# EasyEDA Pro project the ties .epro, schematic Schematic1

## Sheets
1 P1: Board Name: Board1; Create Date: 2026-04-29; Page Name: P1; Project Name: the ties 1; Schematic Name: Schematic1; Update Date: 2026-05-16; Company: EasyEDA.com; Page Size: A4; Version: V1.0
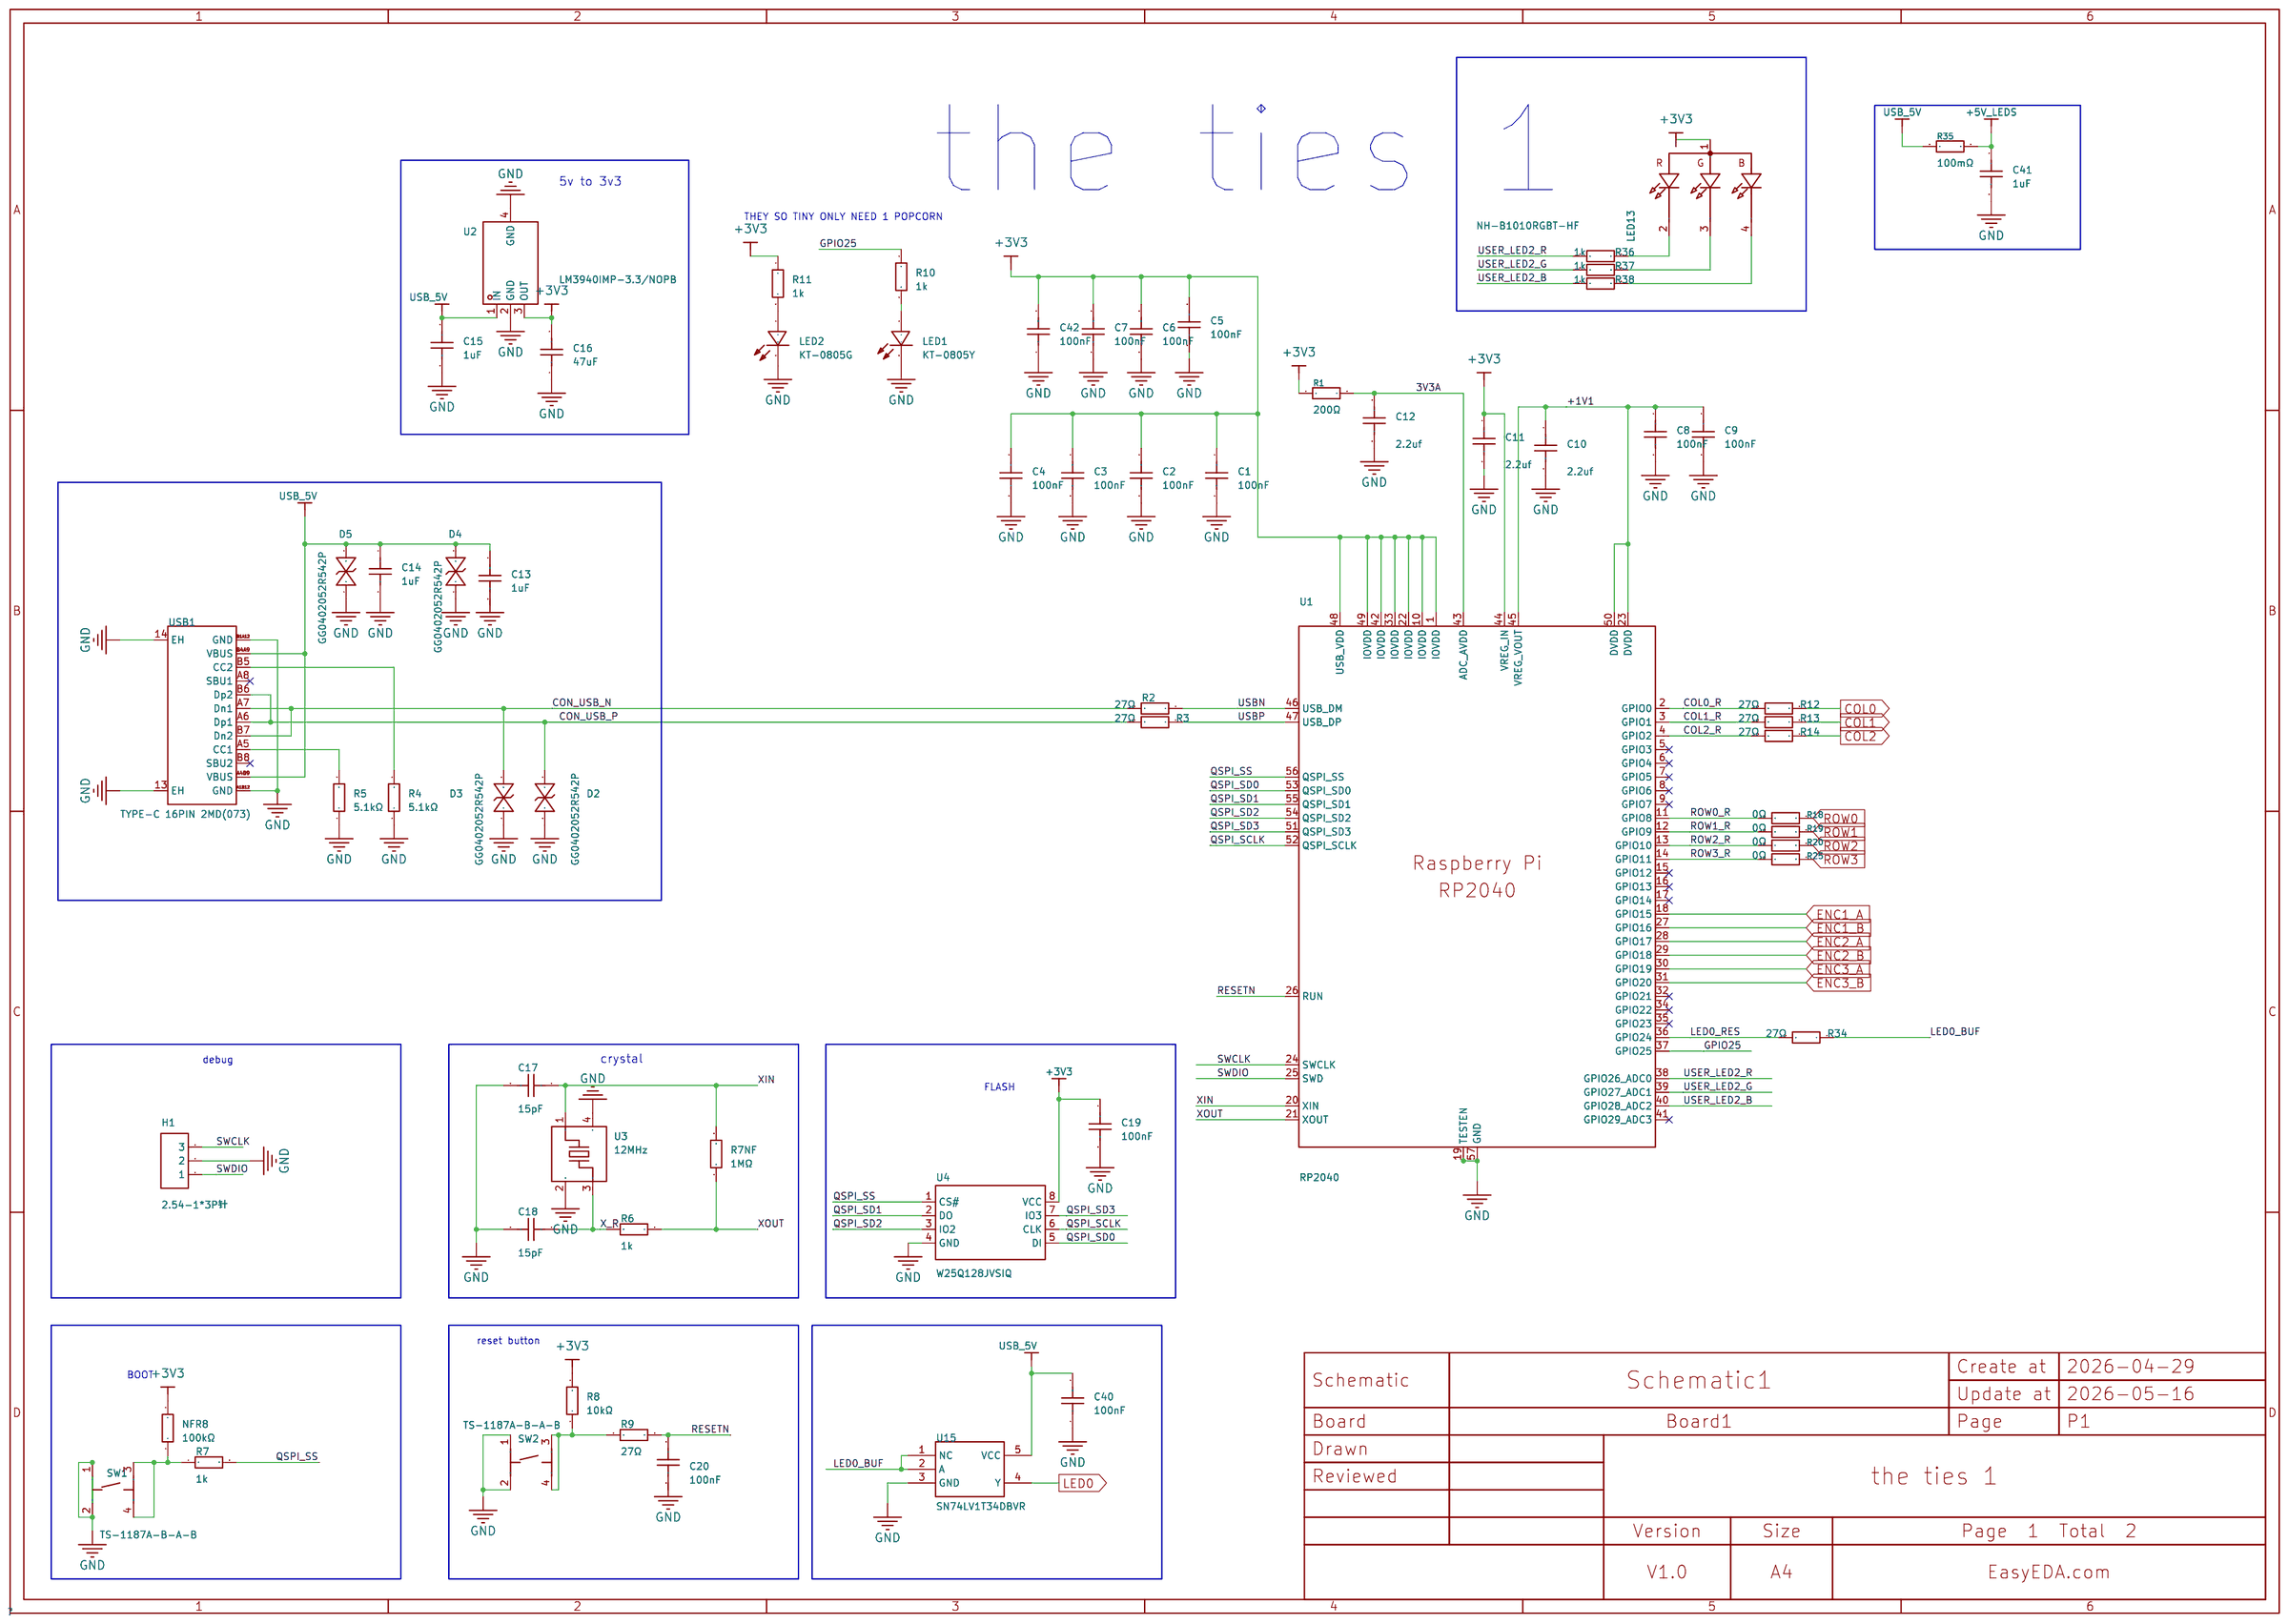
[diagram p0: P1]
2 P2: Page Name: P2
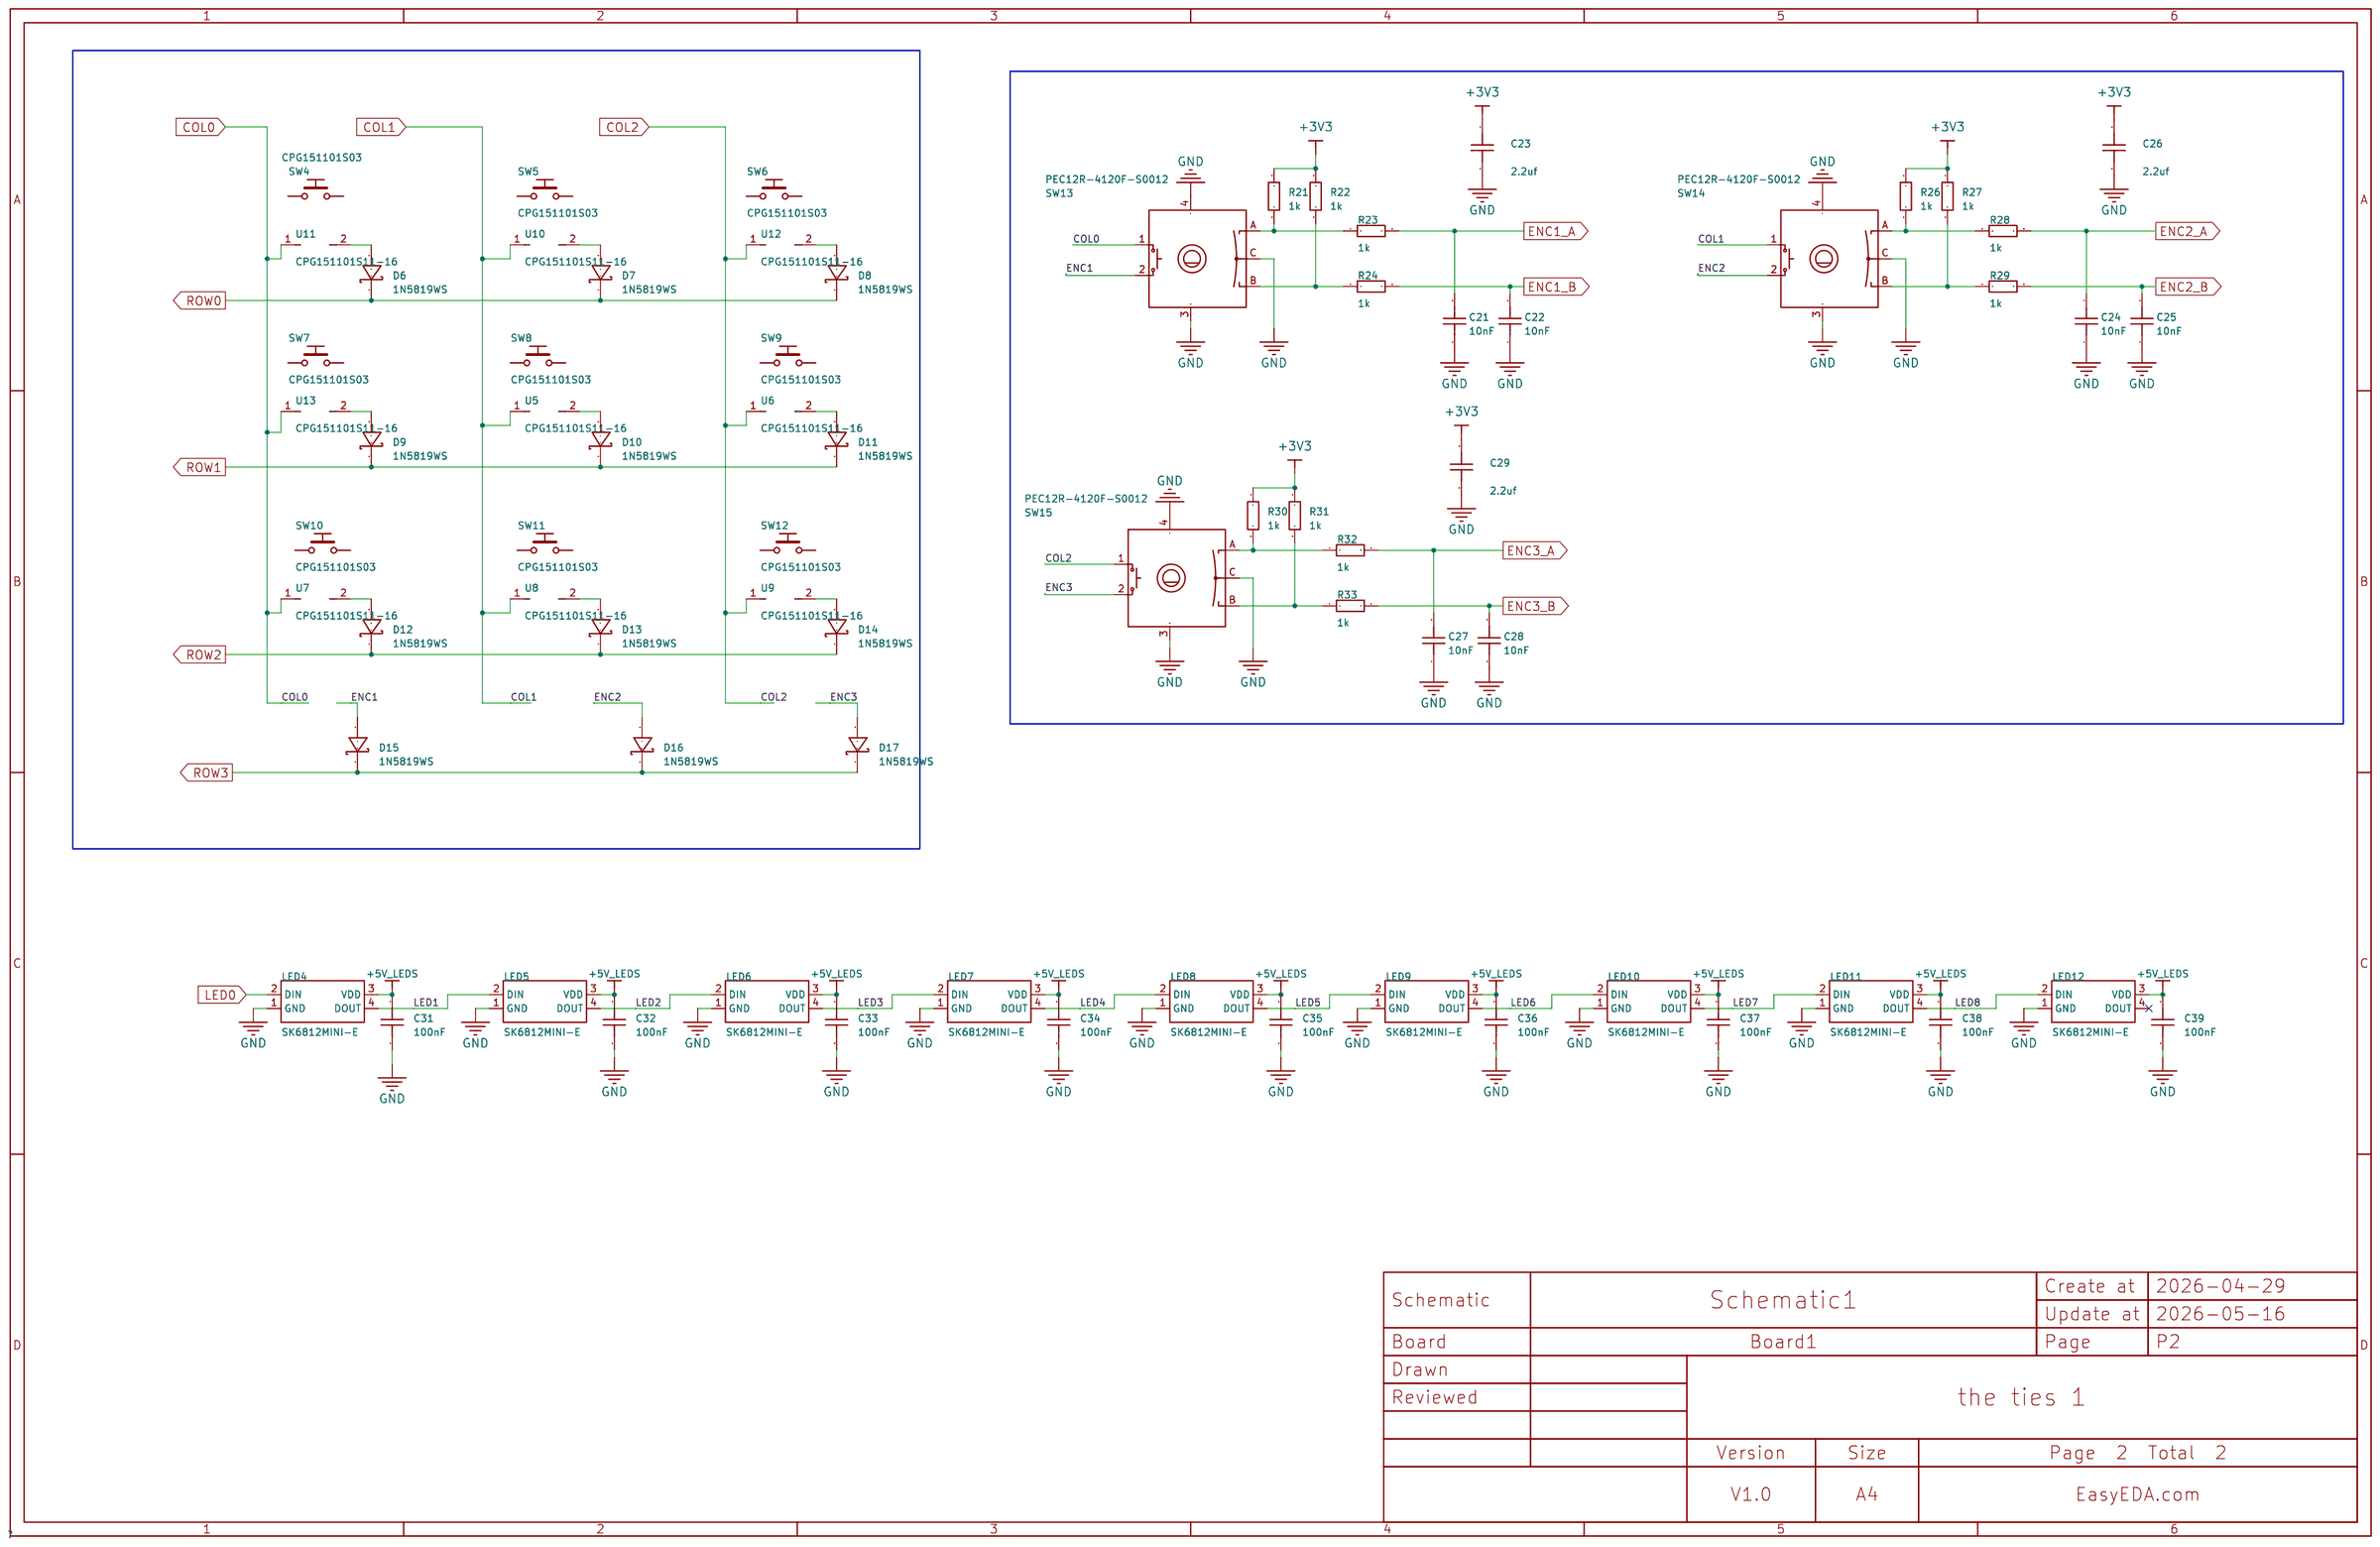
[diagram p1: P2]

## Parts
sheet P1
C1  100nF  [C0603]
C2  100nF  [C0603]
C3  100nF  [C0603]
C4  100nF  [C0603]
C5  100nF  [C0603]
C6  100nF  [C0603]
C7  100nF  [C0603]
C8  100nF  [C0603]
C9  100nF  [C0603]
C10  2.2uf  [C0603]
C11  2.2uf  [C0603]
C12  2.2uf  [C0603]
C13  1uF  [C0603]
C14  1uF  [C0603]
C15  1uF  [C0603]
C16  47uF  [C1206]
C17  15pF  [C0402]
C18  15pF  [C0402]
C19  100nF  [C0603]
C20  100nF  [C0603]
C40  100nF  [C0603]
C41  1uF  [C0603]
C42  100nF  [C0603]
D2  GG0402052R542P  [D0402-BI]
D3  GG0402052R542P  [D0402-BI]
D4  GG0402052R542P  [D0402-BI]
D5  GG0402052R542P  [D0402-BI]
H1  2.54-1*3P针  [HDR-TH_3P-P2.54-V-M-1]
LED1  KT-0805Y  [LED0805-R-RD]
LED2  KT-0805G  [LED0805-R-RD]
LED13  NH-B1010RGBT-HF  [LED-ARRAY-SMD_4P-L1.0-W1.0-TR_NH-B1010RGBT]
NFR8  100kΩ  [R0603]  (no BOM)
R1  200Ω  [R0402]
R2  27Ω  [R0402]
R3  27Ω  [R0402]
R4  5.1kΩ  [R0603]
R5  5.1kΩ  [R0603]
R6  1k  [R0603]
R7  1k  [R0603]
R7NF  1MΩ  [R0603]  (no BOM)
R8  10kΩ  [R0603]
R9  27Ω  [R0402]
R10  1k  [R0603]
R11  1k  [R0603]
R12  27Ω  [R0402]
R13  27Ω  [R0402]
R14  27Ω  [R0402]
R18  0Ω  [R0402]
R19  0Ω  [R0402]
R20  0Ω  [R0402]
R25  0Ω  [R0402]
R34  27Ω  [R0402]
R35  100mΩ  [R1206]
R36  1k  [R0603]
R37  1k  [R0603]
R38  1k  [R0603]
SW1  TS-1187A-B-A-B  [SW-SMD_4P-L5.1-W5.1-P3.70-LS6.5-TL_H1.5]
SW2  TS-1187A-B-A-B  [SW-SMD_4P-L5.1-W5.1-P3.70-LS6.5-TL_H1.5]
U1  RP2040  [LQFN-56_L7.0-W7.0-P0.4-EP]
U2  LM3940IMP-3.3/NOPB  [SOT-223_L6.5-W3.5-P2.30-LS7.0-BR]
U3  12MHz  [CRYSTAL-SMD_4P-L3.2-W2.5-BL]
U4  W25Q128JVSIQ  [SOIC-8_L5.3-W5.3-P1.27-LS8.0-BL]
U15  SN74LV1T34DBVR  [SOT-23-5_L2.9-W1.6-P0.95-LS2.8-BR]
USB1  TYPE-C 16PIN 2MD(073)  [USB-C-SMD_TYPE-C-16PIN-2MD-073]
sheet P2
C21  10nF  [C0603]
C22  10nF  [C0603]
C23  2.2uf  [C0603]
C24  10nF  [C0603]
C25  10nF  [C0603]
C26  2.2uf  [C0603]
C27  10nF  [C0603]
C28  10nF  [C0603]
C29  2.2uf  [C0603]
C31  100nF  [C0603]
C32  100nF  [C0603]
C33  100nF  [C0603]
C34  100nF  [C0603]
C35  100nF  [C0603]
C36  100nF  [C0603]
C37  100nF  [C0603]
C38  100nF  [C0603]
C39  100nF  [C0603]
D6  1N5819WS  [SOD-323_L1.8-W1.3-LS2.5-RD]
D7  1N5819WS  [SOD-323_L1.8-W1.3-LS2.5-RD]
D8  1N5819WS  [SOD-323_L1.8-W1.3-LS2.5-RD]
D9  1N5819WS  [SOD-323_L1.8-W1.3-LS2.5-RD]
D10  1N5819WS  [SOD-323_L1.8-W1.3-LS2.5-RD]
D11  1N5819WS  [SOD-323_L1.8-W1.3-LS2.5-RD]
D12  1N5819WS  [SOD-323_L1.8-W1.3-LS2.5-RD]
D13  1N5819WS  [SOD-323_L1.8-W1.3-LS2.5-RD]
D14  1N5819WS  [SOD-323_L1.8-W1.3-LS2.5-RD]
D15  1N5819WS  [SOD-323_L1.8-W1.3-LS2.5-RD]
D16  1N5819WS  [SOD-323_L1.8-W1.3-LS2.5-RD]
D17  1N5819WS  [SOD-323_L1.8-W1.3-LS2.5-RD]
LED4  SK6812MINI-E  [LED-SMD_4P-L3.2-W2.8-LS5.9_SK6812MINI-E]
LED5  SK6812MINI-E  [LED-SMD_4P-L3.2-W2.8-LS5.9_SK6812MINI-E]
LED6  SK6812MINI-E  [LED-SMD_4P-L3.2-W2.8-LS5.9_SK6812MINI-E]
LED7  SK6812MINI-E  [LED-SMD_4P-L3.2-W2.8-LS5.9_SK6812MINI-E]
LED8  SK6812MINI-E  [LED-SMD_4P-L3.2-W2.8-LS5.9_SK6812MINI-E]
LED9  SK6812MINI-E  [LED-SMD_4P-L3.2-W2.8-LS5.9_SK6812MINI-E]
LED10  SK6812MINI-E  [LED-SMD_4P-L3.2-W2.8-LS5.9_SK6812MINI-E]
LED11  SK6812MINI-E  [LED-SMD_4P-L3.2-W2.8-LS5.9_SK6812MINI-E]
LED12  SK6812MINI-E  [LED-SMD_4P-L3.2-W2.8-LS5.9_SK6812MINI-E]
R21  1k  [R0603]
R22  1k  [R0603]
R23  1k  [R0603]
R24  1k  [R0603]
R26  1k  [R0603]
R27  1k  [R0603]
R28  1k  [R0603]
R29  1k  [R0603]
R30  1k  [R0603]
R31  1k  [R0603]
R32  1k  [R0603]
R33  1k  [R0603]
SW4  CPG151101S03  [KEY-TH_CPG1511F01S0X]
SW5  CPG151101S03  [KEY-TH_CPG1511F01S0X]
SW6  CPG151101S03  [KEY-TH_CPG1511F01S0X]
SW7  CPG151101S03  [KEY-TH_CPG1511F01S0X]
SW8  CPG151101S03  [KEY-TH_CPG1511F01S0X]
SW9  CPG151101S03  [KEY-TH_CPG1511F01S0X]
SW10  CPG151101S03  [KEY-TH_CPG1511F01S0X]
SW11  CPG151101S03  [KEY-TH_CPG1511F01S0X]
SW12  CPG151101S03  [KEY-TH_CPG1511F01S0X]
SW13  PEC12R-4120F-S0012  [SW-TH_PEC12R-4120F-S0012]
SW14  PEC12R-4120F-S0012  [SW-TH_PEC12R-4120F-S0012]
SW15  PEC12R-4120F-S0012  [SW-TH_PEC12R-4120F-S0012]
U5  CPG151101S11-16  [SMD_KEYBOARD-SW]
U6  CPG151101S11-16  [SMD_KEYBOARD-SW]
U7  CPG151101S11-16  [SMD_KEYBOARD-SW]
U8  CPG151101S11-16  [SMD_KEYBOARD-SW]
U9  CPG151101S11-16  [SMD_KEYBOARD-SW]
U10  CPG151101S11-16  [SMD_KEYBOARD-SW]
U11  CPG151101S11-16  [SMD_KEYBOARD-SW]
U12  CPG151101S11-16  [SMD_KEYBOARD-SW]
U13  CPG151101S11-16  [SMD_KEYBOARD-SW]

## Library data of the parts
C1-C15 C19-C29 C31-C42 = CAP_0603: Supplier Footprint: 0603
C16 = CL31A476MPHNNNE: Capacitance:47uF Tolerance:±20% Tolerance:±20% Voltage Rating:10V Temperature Coefficient:X5R; LCSC Part Name: 47uF ±20% 10V; Supplier Part: C96123; Manufacturer: SAMSUNG(三星); Supplier Footprint: 1206; JLCPCB Part Class: Basic Part; Datasheet: https://item.szlcsc.com/datasheet/CL31A476MPHNNNE/97327.html; Supplier: LCSC; Tolerance: ±20%; Voltage Rating: 10V; Temperature Coefficient: X5R
C17 C18 = CL05C150JB5NNNC: Capacitance:15pF Tolerance:±5% Tolerance:±5% Voltage Rating:50V Temperature Coefficient:C0G; LCSC Part Name: 15pF ±5% 50V; Supplier Part: C86285; Manufacturer: SAMSUNG(三星); Supplier Footprint: 0402; JLCPCB Part Class: Extended Part; Datasheet: https://item.szlcsc.com/datasheet/CL05C150JB5NNNC/87461.html; Supplier: LCSC; Tolerance: ±5%; Voltage Rating: 50V; Temperature Coefficient: C0G
D2-D5 = GG0402052R542P: Reverse Stand-Off Voltage (Vrwm):5V Clamping Voltage:15.5V Peak Pulse Current (Ipp):3A@8/20us Peak Pulse Power Dissipation (Ppp):46W@8/20us Voltage - Breakdown:5.5V Reverse Leakage Current (Ir):100nA Operating Temperature:-55℃~+125℃ Operating Temperature:; LCSC Part Name: ESD 5V截止 峰值脉冲电流：3A@8/20us; Supplier Part: C1973257; Manufacturer: Kyocera AVX; Supplier Footprint: 0402; JLCPCB Part Class: Extended Part; Supplier: LCSC; Reverse Stand-Off Voltage (Vrwm): 5V; Clamping Voltage: 15.5V; Peak Pulse Current (Ipp): 3A@8/20us; Peak Pulse Power Dissipation (Ppp): 46W@8/20us; Voltage - Breakdown: 5.5V; Reverse Leakage Current (Ir): 100nA; Operating Temperature: -55℃~+125℃; level of protection: IEC 61000-4-4；IEC 61000-4-2; Type: ESD; Junction Capacitance: 2.5pF
H1 = 2.54-1*3P针: Pin Structure:1x3P Pitch:2.54mm Row Spacing:- Circluar Pins/Square Pins:Pin Header Mounting Type:Through Hole Number of Rows:1 Number of Pins:3P Current Rating:3A Voltage Rating (Max):- Length of Mating Pin:6mm Insulation Height:2.5mm Length of End Connec; LCSC Part Name: 1x3P 间距:2.54mm 方针 直插; Supplier Part: C49257; Manufacturer: BOOMELE(博穆精密); Supplier Footprint: 插件,P=2.54mm; JLCPCB Part Class: Extended Part; Datasheet: https://item.szlcsc.com/datasheet/2.54-1*3P%25E9%2592%2588/50265.html; Supplier: LCSC; Pin Structure: 1x3P; Pitch: 2.54mm; Circluar Pins/Square Pins: Pin Header; Mounting Type: Through Hole; Number of Rows: 1; Number of Pins: 3P; Current Rating: 3A; Length of Mating Pin: 6mm; Insulation Height: 2.5mm; Length of End Connection Pin: 3mm; Contact Material: Brass; Contact Plating: Gold; Operating Temperature: -40℃~+105℃; Color: Black
LED1 = KT-0805Y: Lamp Holder Type:- Illumination Color:Yellow Voltage - Forward(Vf):1.8V~2.4V Voltage - Forward(Vf):1.8V~2.4V Power(Watts):40mW Forward Current:- Wavelength - Dominant:584nm~594nm Wavelength - Dominant:584nm~594nm Peak Wavelength:596nm Diode Configuration:; LCSC Part Name: 0805 黄灯 高亮; Supplier Part: C2296; Manufacturer: KENTO; Supplier Footprint: 0805; JLCPCB Part Class: Basic Part; Datasheet: https://item.szlcsc.com/datasheet/KT-0805Y/2669.html; Supplier: LCSC; Illumination Color: Yellow; Voltage - Forward(Vf): 1.8V~2.4V; Power(Watts): 40mW; Wavelength - Dominant: 584nm~594nm; Peak Wavelength: 596nm; Diode Configuration: Discrete Diode; Lens Color: Water Clear; Luminous Intensity: 175mcd; Viewing Angle: 120°; Operating Temperature: -40℃~+85℃
LED2 = KT-0805G: Lamp Holder Type:- Illumination Color:Emerald Green Voltage - Forward(Vf):2.6V~3.1V Voltage - Forward(Vf):2.6V~3.1V Power(Watts):100mW Forward Current:5mA Wavelength - Dominant:513nm~528nm Wavelength - Dominant:513nm~528nm Peak Wavelength:525nm Diode Conf; LCSC Part Name: 0805 翠绿 高亮; Supplier Part: C2297; Manufacturer: KENTO; Supplier Footprint: 0805; JLCPCB Part Class: Basic Part; Datasheet: https://item.szlcsc.com/datasheet/KT-0805G/2670.html; Supplier: LCSC; Illumination Color: Emerald Green; Voltage - Forward(Vf): 2.6V~3.1V; Power(Watts): 100mW; Forward Current: 5mA; Wavelength - Dominant: 513nm~528nm; Peak Wavelength: 525nm; Diode Configuration: Discrete Diode; Lens Color: Water Clear; Luminous Intensity: 430mcd; Viewing Angle: 120°; Operating Temperature: -40℃~+85℃
LED13 = NH-B1010RGBT-HF-EDIT: Diode Configuration:Common Anode Wavelength - Dominant:R:620nm；G:530nm；B:470nm Luminous Intensity:R:18mcd；G:25mcd；B:4.5mcd Viewing Angle:120° Forward Current:B:2mA；G:2mA；R:5mA Forward Voltage(Vf):R:2V；G:2.6V；B:2.7V Installation Method:op View Mount Operat; LCSC Part Name: 贴片全彩LED; Supplier Part: C2874113; Manufacturer: 国星光电; Supplier Footprint: SMD-4P,1x1mm; Datasheet: https://item.szlcsc.com/datasheet/NH-B1010RGBT-HF/3078825.html; Supplier: LCSC; Diode Configuration: Common Anode; Wavelength - Dominant: R:620nm；G:530nm；B:470nm; Luminous Intensity: R:18mcd；G:25mcd；B:4.5mcd; Viewing Angle: 120°; Forward Current: B:2mA；G:2mA；R:5mA; Forward Voltage(Vf): R:2V；G:2.6V；B:2.7V; Installation Method: op View Mount; Operating Temperature: -30℃~+85℃
NFR8 R4-R7 R7NF R8 R10 R11 R21-R24 R26-R33 R36-R38 = Res_0603: Supplier Footprint: 0603
R1 = 0402WGF2000TCE: Type:Thick Film Resistor Resistance:200Ω Tolerance:±1% Tolerance:±1% Power(Watts):62.5mW Voltage-Supply(Max):50V Temperature Coefficient:±100ppm/℃ Temperature Coefficient:±100ppm/℃ Operating Temperature:-55℃~+155℃ Operating Temperature:-55℃~+155℃; LCSC Part Name: 200Ω ±1% 62.5mW 厚膜电阻; Supplier Part: C25087; Manufacturer: UNI-ROYAL(厚声); Supplier Footprint: 0402; JLCPCB Part Class: Basic Part; Datasheet: https://item.szlcsc.com/datasheet/0402WGF2000TCE/25830.html; Supplier: LCSC; Type: Thick Film Resistor; Tolerance: ±1%; Power(Watts): 62.5mW; Voltage-Supply(Max): 50V; Temperature Coefficient: ±100ppm/℃; Operating Temperature: -55℃~+155℃
R2 R3 R9 R12-R14 R34 = 0402WGF270JTCE: Type:Thick Film Resistor Resistance:27Ω Tolerance:±1% Tolerance:±1% Power(Watts):62.5mW Voltage-Supply(Max):50V Temperature Coefficient:±100ppm/℃ Temperature Coefficient:±100ppm/℃ Operating Temperature:-55℃~+155℃ Operating Temperature:-55℃~+155℃; LCSC Part Name: 27Ω ±1% 62.5mW 厚膜电阻; Supplier Part: C25100; Manufacturer: UNI-ROYAL(厚声); Supplier Footprint: 0402; JLCPCB Part Class: Extended Part; Datasheet: https://item.szlcsc.com/datasheet/0402WGF270JTCE/25843.html; Supplier: LCSC; Type: Thick Film Resistor; Tolerance: ±1%; Power(Watts): 62.5mW; Voltage-Supply(Max): 50V; Temperature Coefficient: ±100ppm/℃; Operating Temperature: -55℃~+155℃
R18-R20 R25 = 0402WGF0000TCE: Type:Thick Film Resistor Resistance:0Ω Tolerance:±1% Tolerance:±1% Power(Watts):62.5mW Voltage-Supply(Max):50V Temperature Coefficient:±800ppm/℃ Temperature Coefficient:±800ppm/℃ Operating Temperature:-55℃~+155℃ Operating Temperature:-55℃~+155℃; LCSC Part Name: 0Ω ±1% 62.5mW 厚膜电阻; Supplier Part: C17168; Manufacturer: UNI-ROYAL(厚声); Supplier Footprint: 0402; JLCPCB Part Class: Basic Part; Datasheet: https://item.szlcsc.com/datasheet/0402WGF0000TCE/17853.html; Supplier: LCSC; Type: Thick Film Resistor; Tolerance: ±1%; Power(Watts): 62.5mW; Voltage-Supply(Max): 50V; Temperature Coefficient: ±800ppm/℃; Operating Temperature: -55℃~+155℃
R35 = 1206W4F100LT5E: Type:Thick Film Resistor Resistance:100mΩ Tolerance:±1% Tolerance:±1% Power(Watts):250mW Voltage-Supply(Max):200V Temperature Coefficient:±800ppm/℃ Temperature Coefficient:±800ppm/℃ Operating Temperature:-55℃~+155℃ Operating Temperature:-55℃~+155℃; LCSC Part Name: 100mΩ ±1% 250mW 厚膜电阻; Supplier Part: C25334; Manufacturer: UNI-ROYAL(厚声); Supplier Footprint: 1206; JLCPCB Part Class: Basic Part; Datasheet: https://item.szlcsc.com/datasheet/1206W4F100LT5E/26077.html; Supplier: LCSC; Type: Thick Film Resistor; Tolerance: ±1%; Power(Watts): 250mW; Voltage-Supply(Max): 200V; Temperature Coefficient: ±800ppm/℃; Operating Temperature: -55℃~+155℃
SW1 SW2 = TS-1187A-B-A-B: Circuit:SPST Actuator Style:Round Button Operating Force:1.6N Mounting Type:Surface Mount,Vertical Length:5.1mm Width:5.1mm Switch Height:1.5mm with Bracket:Without Bracket Contact Current:50mA Voltage Rating:12V Actuator/Cap Color:Gold With Lamp:No Life:; LCSC Part Name: 5.1*5.1*1.5mm 立贴 轻触开关; Supplier Part: C318884; Manufacturer: XKB Connection(中国星坤); Supplier Footprint: SMD; JLCPCB Part Class: Basic Part; Datasheet: https://item.szlcsc.com/datasheet/TS-1187A-B-A-B/299976.html; Supplier: LCSC; Circuit: SPST; Actuator Style: Round Button; Operating Force: 1.6N; Mounting Type: Surface Mount,Vertical; Length: 5.1mm; Width: 5.1mm; Switch Height: 1.5mm; with Bracket: Without Bracket; Contact Current: 50mA; Voltage Rating: 12V; Actuator/Cap Color: Gold; With Lamp: No; Life: 100,000 Cycles; Operating Temperature: -30℃~+85℃
U1 = RP2040_C2040_Rf_1: CPU Core:- CPU Maximum Speed:133MHz Number of I/O:30 ADC (Bit):12bit; LCSC Part Name: RP2040（RP2B2）; Supplier Part: C2040; Manufacturer: Raspberry Pi(树莓派); Supplier Footprint: LQFN-56(7x7); Datasheet: https://item.szlcsc.com/datasheet/RP2040/2392.html; Supplier: LCSC; CPU Maximum Speed: 133MHz; Number of I/O: 30; ADC (Bit): 12bit
U2 = LM3940IMP-3.3/NOPB: Output Type:Fixed Voltage - Supply:5.5V Output Voltage:3.3V Output Voltage:3.3V Output Current:1A Power Supply Rejection Ratio (PSRR):- Voltage Dropout:500mV@(1A) standby current:10mA Noise:250uVrms Features:Over Current Protection；Short Circuit Protectio; LCSC Part Name: 3.3V 1A 5.5V; Supplier Part: C140319; Manufacturer: TI(德州仪器); Supplier Footprint: SOT-223; JLCPCB Part Class: Extended Part; Datasheet: https://www.ti.com/cn/lit/gpn/lm3940; Supplier: LCSC; Output Type: Fixed; Voltage - Supply: 5.5V; Output Voltage: 3.3V; Output Current: 1A; Voltage Dropout: 500mV@(1A); standby current: 10mA; Noise: 250uVrms; Features: Over Current Protection；Short Circuit Protection；Over Temperature Protection; Operating Temperature: -40℃~+125℃@(Tj); Output Configuration: Positive; Number of Outputs: 1
U3 = ABM8-272-T3_C20625731: Type:Crystal Oscillator Frequency:12MHz Normal temperature Frequency Tolerance:±30ppm Normal temperature Frequency Tolerance:±30ppm Load Capacitance:10pF Frequency Stability:±30ppm Frequency Stability:±30ppm Equivalent Series Resistance(ESR):50Ω Operating; LCSC Part Name: 12MHz ±30ppm 10pF; Supplier Part: C20625731; Manufacturer: ABRACON; Manufacturer Part: ABM8-272-T3; Supplier Footprint: SMD3225-4P; JLCPCB Part Class: Extended Part; Datasheet: https://item.szlcsc.com/datasheet/ABM8-272-T3/22032038.html; Supplier: LCSC; Type: Crystal Oscillator; Normal temperature Frequency Tolerance: ±30ppm; Load Capacitance: 10pF; Frequency Stability: ±30ppm; Equivalent Series Resistance(ESR): 50Ω; Operating Temperature: -40℃~+85℃
U4 = W25Q128JVSIQ: Interface:SPI Memory Size:128Mbit Clock Frequency:133MHz Voltage - Supply:2.7V~3.6V Voltage - Supply:2.7V~3.6V Standby Supply Current:1uA Program / Erase Cycles:100,000 Cycles Page Programming Time (Tpp):3ms Block Erase Time(tBE):120ms@(32KB) Data Retenti; LCSC Part Name: 编带 支持双路/四路SPI接口的3V、128Mbit 串行闪存; Supplier Part: C97521; Manufacturer: Winbond(华邦); Supplier Footprint: SOIC-8-208mil; JLCPCB Part Class: Basic Part; Datasheet: https://item.szlcsc.com/datasheet/W25Q128JVSIQ/98729.html; Supplier: LCSC; Interface: SPI; Memory Size: 128Mbit; Clock Frequency: 133MHz; Voltage - Supply: 2.7V~3.6V; Standby Supply Current: 1uA; Program / Erase Cycles: 100,000 Cycles; Page Programming Time (Tpp): 3ms; Block Erase Time(tBE): 120ms@(32KB); Data Retention - TDR (Year): 20 Years; Operating Temperature: -40℃~+85℃
U15 = SN74LV1T34DBVR edit: Input type:- output type:Push-pull Voltage - Supply:1.6V~5.5V Voltage - Supply:1.6V~5.5V Number of Elements:1 Number of Bits per Element:1 Channel Type:Unidirectional Current - Output Low(IOL):8mA Current - Output High(IOH):8mA Logic Family:74LV Operating; LCSC Part Name: 单电源单缓冲门CMOS逻辑电平转换器; Supplier Part: C100024; Manufacturer: TI(德州仪器); Supplier Footprint: SOT-23-5; Datasheet: https://www.ti.com/cn/lit/gpn/sn74lv1t34; Supplier: LCSC; output type: Push-pull; Voltage - Supply: 1.6V~5.5V; Number of Elements: 1; Number of Bits per Element: 1; Channel Type: Unidirectional; Current - Output Low(IOL): 8mA; Current - Output High(IOH): 8mA; Logic Family: 74LV; Operating Temperature: -40℃~+125℃; Quiescent Current: 10uA; Propagation Delay: 5.5ns@5.0V,15pF
USB1 = TYPE-C 16PIN 2MD(073): Connector Type:Type-C Protocol Standard:- Gender:Female Mounting Type:Surface Mount, Right Angle Number of Contacts:16P Number of Ports:1 Current Rating-Power:3A Voltage Rating:5V Connect-Disconnect Life:10,000 Cycles Supplementary Features:- Center Heigh; LCSC Part Name: Type-C 母 卧贴; Supplier Part: C2765186; Manufacturer: SHOU HAN(首韩); Supplier Footprint: SMD; JLCPCB Part Class: Extended Part; Datasheet: https://item.szlcsc.com/datasheet/TYPE-C%252016PIN%25202MD(073)/2901843.html; Supplier: LCSC; Connector Type: Type-C; Gender: Female; Mounting Type: Surface Mount, Right Angle; Number of Contacts: 16P; Number of Ports: 1; Current Rating-Power: 3A; Voltage Rating: 5V; Connect-Disconnect Life: 10,000 Cycles; Detection color: Black; Operating Temperature: -25℃~+85℃
D6-D17 = 1N5819WS_C191023: Voltage - Forward(Vf@If):600mV@1A Voltage - DC Reverse(Vr):40V Current - Rectified:1A Non-Repetitive Peak Forward Surge Current:25A; LCSC Part Name: 电压:40V 电流:1A; Supplier Part: C191023; Manufacturer: Hottech(合科泰); Supplier Footprint: SOD-323; JLCPCB Part Class: Basic Part; Datasheet: https://item.szlcsc.com/datasheet/1N5819WS/213850.html; Supplier: LCSC; Voltage - Forward(Vf@If): 600mV@1A; Voltage - DC Reverse(Vr): 40V; Current - Rectified: 1A; Non-Repetitive Peak Forward Surge Current: 25A
LED4-LED12 = SK6812MINI-E_C5149201: Wavelength:R:620nm~625nm；B:460nm~470nm；G:515nm~525nm Luminous Intensity:R:160mcd~320mcd；B:120mcd~240mcd；G:815mcd~1275mcd Fixed-Frequency Pwm Mode:1kHz Data Transmission Rate:800Kbit/s Voltage - Supply:3.7V~5.5V Voltage - Supply:3.7V~5.5V Quiescent Current; LCSC Part Name: 工作电压5V、发光角度120°、灰度调节256级的RGB LED; Supplier Part: C5149201; Manufacturer: 欧思科光电; Supplier Footprint: SMD; JLCPCB Part Class: Extended Part; Datasheet: https://item.szlcsc.com/datasheet/SK6812MINI-E/5773397.html; Supplier: LCSC; Wavelength: R:620nm~625nm；B:460nm~470nm；G:515nm~525nm; Luminous Intensity: R:160mcd~320mcd；B:120mcd~240mcd；G:815mcd~1275mcd; Fixed-Frequency Pwm Mode: 1kHz; Data Transmission Rate: 800Kbit/s; Voltage - Supply: 3.7V~5.5V; Quiescent Current: 0.6mA; Lens Color: Semi-transparent lens; ESD Withstand Voltage: 2000V; Operating Temperature: -40℃~+85℃; Viewing Angle: 120°; Length: 3.2mm; Width: 1.78mm; Height: 2.8mm
SW4-SW12 = CPG151101S03 edit: Axis Type:Black shaft Operating Voltage:2V~12V Operating Voltage:2V~12V Pin:2 Mechanical Life:70 Million Times Operation Force:60gf@±10gf Conduction Travel:1.9mm Total Travel:4mm Operating Temperature:-10℃~+70℃ Operating Temperature:-10℃~+70℃; LCSC Part Name: KT 黑轴; Supplier Part: C404350; Manufacturer: Kailh(凯华); Supplier Footprint: 插件; Datasheet: https://atta.szlcsc.com/upload/public/pdf/source/20190830/C404350_7AC4D94D5466618D1CC3585CDFC62D55.pdf; Supplier: LCSC; Axis Type: Black shaft; Operating Voltage: 2V~12V; Pin: 2; Mechanical Life: 70 Million Times; Operation Force: 60gf@±10gf; Conduction Travel: 1.9mm; Total Travel: 4mm; Operating Temperature: -10℃~+70℃
SW13-SW15 = PEC12R-4120F-S0012 edit: Encoder Type:Incremental Number of Detents / Pulses (Incremental):12/12 Output Form:Two-phase output Mounting Type:Straight Current Rating (Max):10mA Rated Voltage (Max):5V Operating Temperature:-30℃~+70℃ Operating Temperature:-30℃~+70℃; LCSC Part Name: 增量编码器; Supplier Part: C143801; Manufacturer: BOURNS; Supplier Footprint: 插件; Datasheet: https://item.szlcsc.com/datasheet/PEC12R-4120F-S0012/155132.html; Supplier: LCSC; Encoder Type: Incremental; Number of Detents / Pulses (Incremental): 12/12; Output Form: Two-phase output; Mounting Type: Straight; Current Rating (Max): 10mA; Rated Voltage (Max): 5V; Operating Temperature: -30℃~+70℃
U5-U13 = CPG151101S11-16-asas: Axis Type:- Operating Voltage:2V~12V Operating Voltage:2V~12V Pin:- Mechanical Life:- Operation Force:- Conduction Travel:- Total Travel:- Operating Temperature:- Operating Temperature:-; Supplier Part: C5156480; Manufacturer: Kailh(凯华); Datasheet: https://atta.szlcsc.com/upload/public/pdf/source/20220829/33DFC1A320A078D20879F2B21562B513.pdf; Supplier: LCSC; Operating Voltage: 2V~12V

## Nets
3V3A: C12.1 R1.2 U1.43(ADC_AVDD)
+1V1: C8.1 C9.1 C10.1 U1.23(DVDD) U1.45(VREG_VOUT) U1.50(DVDD)
+3V3: C1.1 C2.1 C3.1 C4.1 C5.2 C6.2 C7.2 C11.1 C16.2 C19.1 C23.1 C26.1 C29.1 C42.2 LED13.1(+) NFR8.2 R1.1 R8.2 R11.1 R21.1 R22.1 R26.1 R27.1 R30.1 R31.1 U1.1(IOVDD) U1.10(IOVDD) U1.22(IOVDD) U1.33(IOVDD) U1.42(IOVDD) U1.44(VREG_IN) U1.48(USB_VDD) U1.49(IOVDD) U2.3(OUT) U4.8(VCC)
+5V_LEDS: C31.1 C32.1 C33.1 C34.1 C35.1 C36.1 C37.1 C38.1 C39.1 C41.1 LED4.3(VDD) LED5.3(VDD) LED6.3(VDD) LED7.3(VDD) LED8.3(VDD) LED9.3(VDD) LED10.3(VDD) LED11.3(VDD) LED12.3(VDD) R35.2
GND: C1.2 C2.2 C3.2 C4.2 C5.1 C6.1 C7.1 C8.2 C9.2 C10.2 C11.2 C12.2 C13.2 C14.2 C15.2 C16.1 C17.2 C18.2 C19.2 C20.1 C21.1 C22.1 C23.2 C24.1 C25.1 C26.2 C27.1 C28.1 C29.2 C31.2 C32.2 C33.2 C34.2 C35.2 C36.2 C37.2 C38.2 C39.2 C40.1 C41.2 C42.1 D2.2 D3.1 D4.1 D5.1 H1.2 LED1.2(-) LED2.2(K) LED4.1(GND) LED5.1(GND) LED6.1(GND) LED7.1(GND) LED8.1(GND) LED9.1(GND) LED10.1(GND) LED11.1(GND) LED12.1(GND) R4.1 R5.1 SW1.1(A) SW1.2(B) SW2.1(A) SW2.2(B) SW13.3 SW13.4 SW13.C SW14.3 SW14.4 SW14.C SW15.3 SW15.4 SW15.C U1.19(TESTEN) U1.57(GND) U2.2(GND) U2.4(GND) U3.2(GND) U3.4(GND) U4.4(GND) U15.3(GND) USB1.13(EH) USB1.14(EH) USB1.A1B12(GND) USB1.B1A12(GND)
COL0: R12.1 SW13.1 U7.1 U11.1 U13.1
COL0_R: R12.2 U1.2(GPIO0)
COL1: R13.1 SW14.1 U5.1 U8.1 U10.1
COL1_R: R13.2 U1.3(GPIO1)
COL2: R14.1 SW15.1 U6.1 U9.1 U12.1
COL2_R: R14.2 U1.4(GPIO2)
CON_USB_N: D3.2 R2.2 USB1.A7(Dn1) USB1.B7(Dn2)
CON_USB_P: D2.1 R3.2 USB1.A6(Dp1) USB1.B6(Dp2)
ENC1: D15.2(A) SW13.2
ENC1_A: C21.2 R23.2 U1.18(GPIO15)
ENC1_B: C22.2 R24.2 U1.27(GPIO16)
ENC2: D16.2(A) SW14.2
ENC2_A: C24.2 R28.2 U1.28(GPIO17)
ENC2_B: C25.2 R29.2 U1.29(GPIO18)
ENC3: D17.2(A) SW15.2
ENC3_A: C27.2 R32.2 U1.30(GPIO19)
ENC3_B: C28.2 R33.2 U1.31(GPIO20)
GPIO25: R10.1 U1.37(GPIO25)
LED0: LED4.2(DIN) U15.4(Y)
LED0_BUF: R34.1 U15.1(NC) U15.2(A)
LED0_RES: R34.2 U1.36(GPIO24)
LED1: LED4.4(DOUT) LED5.2(DIN)
LED2: LED5.4(DOUT) LED6.2(DIN)
LED3: LED6.4(DOUT) LED7.2(DIN)
LED4: LED7.4(DOUT) LED8.2(DIN)
LED5: LED8.4(DOUT) LED9.2(DIN)
LED6: LED9.4(DOUT) LED10.2(DIN)
LED7: LED10.4(DOUT) LED11.2(DIN)
LED8: LED11.4(DOUT) LED12.2(DIN)
QSPI_SCLK: U1.52(QSPI_SCLK) U4.6(CLK)
QSPI_SD0: U1.53(QSPI_SD0) U4.5(DI)
QSPI_SD1: U1.55(QSPI_SD1) U4.2(DO)
QSPI_SD2: U1.54(QSPI_SD2) U4.3(IO2)
QSPI_SD3: U1.51(QSPI_SD3) U4.7(IO3)
QSPI_SS: R7.2 U1.56(QSPI_SS) U4.1(CS#)
RESETN: C20.2 R9.2 U1.26(RUN)
ROW0: D6.1(K) D7.1(K) D8.1(K) R18.2
ROW0_R: R18.1 U1.11(GPIO8)
ROW1: D9.1(K) D10.1(K) D11.1(K) R19.2
ROW1_R: R19.1 U1.12(GPIO9)
ROW2: D12.1(K) D13.1(K) D14.1(K) R20.2
ROW2_R: R20.1 U1.13(GPIO10)
ROW3: D15.1(K) D16.1(K) D17.1(K) R25.2
ROW3_R: R25.1 U1.14(GPIO11)
SWCLK: H1.3 U1.24(SWCLK)
SWDIO: H1.1 U1.25(SWD)
USB_5V: C13.1 C14.1 C15.1 C40.2 D4.2 D5.2 R35.1 U2.1(IN) U15.5(VCC) USB1.A4B9(VBUS) USB1.B4A9(VBUS)
USBN: R2.1 U1.46(USB_DM)
USBP: R3.1 U1.47(USB_DP)
USER_LED2_B: R38.1 U1.40(GPIO28_ADC2)
USER_LED2_G: R37.1 U1.39(GPIO27_ADC1)
USER_LED2_R: R36.1 U1.38(GPIO26_ADC0)
X_R: C18.1 R6.2 U3.3
XIN: C17.1 R7NF.2 U1.20(XIN) U3.1
XOUT: R6.1 R7NF.1 U1.21(XOUT)
$1N4579: R5.2 USB1.A5(CC1)
$1N4584: R4.2 USB1.B5(CC2)
$1N7293: NFR8.1 R7.1 SW1.3(C) SW1.4(D)
$1N7582: R8.1 R9.1 SW2.3(C) SW2.4(D)
$1N8008: LED1.1(+) R10.2
$1N8163: LED2.1(A) R11.2
$1N12025: LED13.2(-) R36.2
$1N12030: LED13.3(-) R37.2
$1N12044: LED13.4(-) R38.2
$2N649: D6.2(A) U11.2
$2N758: D7.2(A) U10.2
$2N864: D8.2(A) U12.2
$2N1178: D9.2(A) U13.2
$2N1180: D10.2(A) U5.2
$2N1182: D11.2(A) U6.2
$2N1496: D12.2(A) U7.2
$2N1498: D13.2(A) U8.2
$2N1500: D14.2(A) U9.2
$2N22693: R27.2 R29.1 SW14.B
$2N22698: R26.2 R28.1 SW14.A
$2N22710: R22.2 R24.1 SW13.B
$2N22717: R21.2 R23.1 SW13.A
$2N22729: R31.2 R33.1 SW15.B
$2N22736: R30.2 R32.1 SW15.A

Not connected (* = marked no-connect by the designer): LED12 4(DOUT)*; U1 5(GPIO3)* 6(GPIO4)* 7(GPIO5)* 8(GPIO6)* 9(GPIO7)* 15(GPIO12)* 16(GPIO13)* 17(GPIO14)* 32(GPIO21)* 34(GPIO22)* 35(GPIO23)* 41(GPIO29_ADC3)*; USB1 A8(SBU1)* B8(SBU2)*

## Notes on the sheets
sheet 1
- 5v to 3v3
- the ties 1
- THEY SO TINY ONLY NEED 1 POPCORN
- debug
- crystal
- FLASH
- reset button
- BOOT
